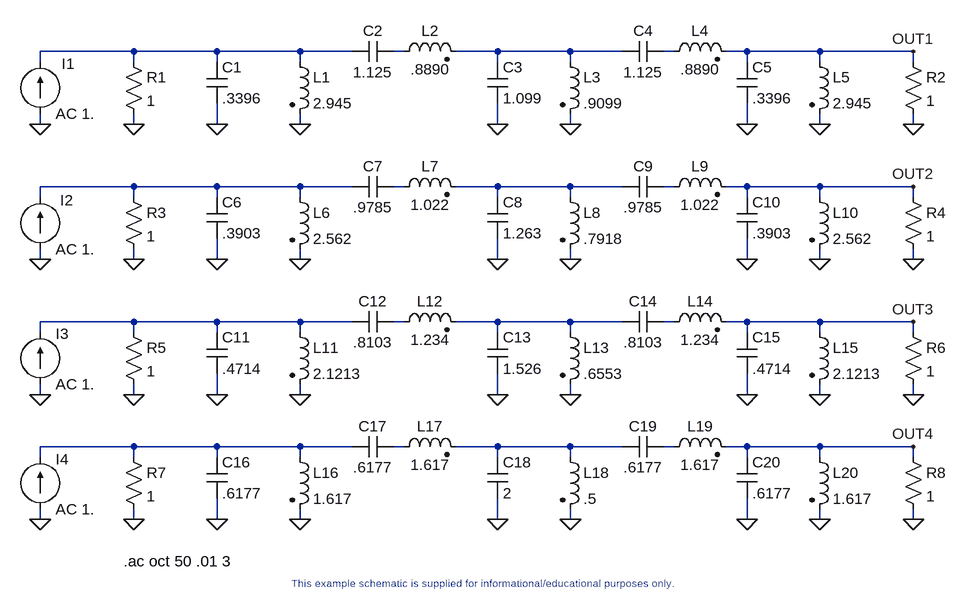
[diagram p0: schematic butter.asc]
butter.asc, the LTspice schematic file:
Version 4
SHEET 1 2536 1712
WIRE 1040 512 896 512
WIRE 1168 512 1040 512
WIRE 1296 512 1168 512
WIRE 1376 512 1296 512
WIRE 1456 512 1440 512
WIRE 1600 512 1536 512
WIRE 1712 512 1600 512
WIRE 1792 512 1712 512
WIRE 1872 512 1856 512
WIRE 1984 512 1952 512
WIRE 2096 512 1984 512
WIRE 2240 512 2096 512
WIRE 896 528 896 512
WIRE 1040 528 1040 512
WIRE 1168 528 1168 512
WIRE 1296 528 1296 512
WIRE 1600 528 1600 512
WIRE 1712 528 1712 512
WIRE 1984 528 1984 512
WIRE 2096 528 2096 512
WIRE 2240 528 2240 512
WIRE 896 624 896 608
WIRE 1040 624 1040 608
WIRE 1168 624 1168 592
WIRE 1296 624 1296 608
WIRE 1600 624 1600 592
WIRE 1712 624 1712 608
WIRE 1984 624 1984 592
WIRE 2096 624 2096 608
WIRE 2240 624 2240 608
WIRE 1040 720 896 720
WIRE 1168 720 1040 720
WIRE 1296 720 1168 720
WIRE 1376 720 1296 720
WIRE 1456 720 1440 720
WIRE 1600 720 1536 720
WIRE 1712 720 1600 720
WIRE 1792 720 1712 720
WIRE 1872 720 1856 720
WIRE 1984 720 1952 720
WIRE 2096 720 1984 720
WIRE 2240 720 2096 720
WIRE 896 736 896 720
WIRE 1040 736 1040 720
WIRE 1168 736 1168 720
WIRE 1296 736 1296 720
WIRE 1600 736 1600 720
WIRE 1712 736 1712 720
WIRE 1984 736 1984 720
WIRE 2096 736 2096 720
WIRE 2240 736 2240 720
WIRE 896 832 896 816
WIRE 1040 832 1040 816
WIRE 1168 832 1168 800
WIRE 1296 832 1296 816
WIRE 1600 832 1600 800
WIRE 1712 832 1712 816
WIRE 1984 832 1984 800
WIRE 2096 832 2096 816
WIRE 2240 832 2240 816
WIRE 1040 928 896 928
WIRE 1168 928 1040 928
WIRE 1296 928 1168 928
WIRE 1376 928 1296 928
WIRE 1456 928 1440 928
WIRE 1600 928 1536 928
WIRE 1712 928 1600 928
WIRE 1792 928 1712 928
WIRE 1872 928 1856 928
WIRE 1984 928 1952 928
WIRE 2096 928 1984 928
WIRE 2240 928 2096 928
WIRE 896 944 896 928
WIRE 1040 944 1040 928
WIRE 1168 944 1168 928
WIRE 1296 944 1296 928
WIRE 1600 944 1600 928
WIRE 1712 944 1712 928
WIRE 1984 944 1984 928
WIRE 2096 944 2096 928
WIRE 2240 944 2240 928
WIRE 896 1040 896 1024
WIRE 1040 1040 1040 1024
WIRE 1168 1040 1168 1008
WIRE 1296 1040 1296 1024
WIRE 1600 1040 1600 1008
WIRE 1712 1040 1712 1024
WIRE 1984 1040 1984 1008
WIRE 2096 1040 2096 1024
WIRE 2240 1040 2240 1024
WIRE 1040 1120 896 1120
WIRE 1168 1120 1040 1120
WIRE 1296 1120 1168 1120
WIRE 1376 1120 1296 1120
WIRE 1456 1120 1440 1120
WIRE 1600 1120 1536 1120
WIRE 1712 1120 1600 1120
WIRE 1792 1120 1712 1120
WIRE 1872 1120 1856 1120
WIRE 1984 1120 1952 1120
WIRE 2096 1120 1984 1120
WIRE 2240 1120 2096 1120
WIRE 896 1136 896 1120
WIRE 1040 1136 1040 1120
WIRE 1168 1136 1168 1120
WIRE 1296 1136 1296 1120
WIRE 1600 1136 1600 1120
WIRE 1712 1136 1712 1120
WIRE 1984 1136 1984 1120
WIRE 2096 1136 2096 1120
WIRE 2240 1136 2240 1120
WIRE 896 1232 896 1216
WIRE 1040 1232 1040 1216
WIRE 1168 1232 1168 1200
WIRE 1296 1232 1296 1216
WIRE 1600 1232 1600 1200
WIRE 1712 1232 1712 1216
WIRE 1984 1232 1984 1200
WIRE 2096 1232 2096 1216
WIRE 2240 1232 2240 1216
FLAG 2240 1120 OUT4
FLAG 2240 928 OUT3
FLAG 2240 720 OUT2
FLAG 2240 512 OUT1
FLAG 896 624 0
FLAG 1040 624 0
FLAG 1168 624 0
FLAG 1296 624 0
FLAG 1600 624 0
FLAG 1712 624 0
FLAG 1984 624 0
FLAG 2096 624 0
FLAG 2240 624 0
FLAG 896 832 0
FLAG 1040 832 0
FLAG 1168 832 0
FLAG 1296 832 0
FLAG 1600 832 0
FLAG 1712 832 0
FLAG 1984 832 0
FLAG 2096 832 0
FLAG 2240 832 0
FLAG 896 1040 0
FLAG 1040 1040 0
FLAG 1168 1040 0
FLAG 1296 1040 0
FLAG 1600 1040 0
FLAG 1712 1040 0
FLAG 1984 1040 0
FLAG 2096 1040 0
FLAG 2240 1040 0
FLAG 896 1232 0
FLAG 1040 1232 0
FLAG 1168 1232 0
FLAG 1296 1232 0
FLAG 1600 1232 0
FLAG 1712 1232 0
FLAG 1984 1232 0
FLAG 2096 1232 0
FLAG 2240 1232 0
SYMBOL CURRENT 896 608 M180
WINDOW 0 33 77 Left 2
WINDOW 3 24 0 Left 2
SYMATTR InstName I1
SYMATTR Value AC 1.
SYMBOL CURRENT 896 816 M180
WINDOW 0 31 75 Left 2
WINDOW 3 24 0 Left 2
SYMATTR InstName I2
SYMATTR Value AC 1.
SYMBOL CURRENT 896 1024 M180
WINDOW 0 24 78 Left 2
WINDOW 3 24 0 Left 2
SYMATTR InstName I3
SYMATTR Value AC 1.
SYMBOL CURRENT 896 1216 M180
WINDOW 0 24 77 Left 2
WINDOW 3 24 0 Left 2
SYMATTR InstName I4
SYMATTR Value AC 1.
SYMBOL RES 1024 512 R0
SYMATTR InstName R1
SYMATTR Value 1
SYMBOL CAP 1856 496 R90
WINDOW 0 0 32 VBottom 2
WINDOW 3 32 32 VTop 2
SYMATTR InstName C4
SYMATTR Value 1.125
SYMBOL CAP 1968 528 R0
SYMATTR InstName C5
SYMATTR Value .3396
SYMBOL CAP 1440 496 R90
WINDOW 0 0 32 VBottom 2
WINDOW 3 32 32 VTop 2
SYMATTR InstName C2
SYMATTR Value 1.125
SYMBOL CAP 1584 528 R0
SYMATTR InstName C3
SYMATTR Value 1.099
SYMBOL CAP 1152 528 R0
SYMATTR InstName C1
SYMATTR Value .3396
SYMBOL CAP 1856 704 R90
WINDOW 0 0 32 VBottom 2
WINDOW 3 32 32 VTop 2
SYMATTR InstName C9
SYMATTR Value .9785
SYMBOL CAP 1968 736 R0
SYMATTR InstName C10
SYMATTR Value .3903
SYMBOL CAP 1440 704 R90
WINDOW 0 0 32 VBottom 2
WINDOW 3 32 32 VTop 2
SYMATTR InstName C7
SYMATTR Value .9785
SYMBOL CAP 1584 736 R0
SYMATTR InstName C8
SYMATTR Value 1.263
SYMBOL CAP 1152 736 R0
SYMATTR InstName C6
SYMATTR Value .3903
SYMBOL CAP 1856 912 R90
WINDOW 0 0 32 VBottom 2
WINDOW 3 32 32 VTop 2
SYMATTR InstName C14
SYMATTR Value .8103
SYMBOL CAP 1968 944 R0
SYMATTR InstName C15
SYMATTR Value .4714
SYMBOL CAP 1440 912 R90
WINDOW 0 0 32 VBottom 2
WINDOW 3 32 32 VTop 2
SYMATTR InstName C12
SYMATTR Value .8103
SYMBOL CAP 1584 944 R0
SYMATTR InstName C13
SYMATTR Value 1.526
SYMBOL CAP 1152 944 R0
SYMATTR InstName C11
SYMATTR Value .4714
SYMBOL CAP 1856 1104 R90
WINDOW 0 0 32 VBottom 2
WINDOW 3 32 32 VTop 2
SYMATTR InstName C19
SYMATTR Value .6177
SYMBOL CAP 1968 1136 R0
SYMATTR InstName C20
SYMATTR Value .6177
SYMBOL CAP 1440 1104 R90
WINDOW 0 0 32 VBottom 2
WINDOW 3 32 32 VTop 2
SYMATTR InstName C17
SYMATTR Value .6177
SYMBOL CAP 1584 1136 R0
SYMATTR InstName C18
SYMATTR Value 2
SYMBOL CAP 1152 1136 R0
SYMATTR InstName C16
SYMATTR Value .6177
SYMBOL IND2 1856 528 R270
WINDOW 0 32 56 VTop 2
WINDOW 3 4 56 VBottom 2
SYMATTR InstName L4
SYMATTR Value .8890
SYMBOL IND2 2080 512 R0
SYMATTR InstName L5
SYMATTR Value 2.945
SYMBOL IND2 1440 528 R270
WINDOW 0 32 56 VTop 2
WINDOW 3 4 56 VBottom 2
SYMATTR InstName L2
SYMATTR Value .8890
SYMBOL IND2 1696 512 R0
SYMATTR InstName L3
SYMATTR Value .9099
SYMBOL IND2 1280 512 R0
SYMATTR InstName L1
SYMATTR Value 2.945
SYMBOL IND2 1856 736 R270
WINDOW 0 32 56 VTop 2
WINDOW 3 4 56 VBottom 2
SYMATTR InstName L9
SYMATTR Value 1.022
SYMBOL IND2 2080 720 R0
SYMATTR InstName L10
SYMATTR Value 2.562
SYMBOL IND2 1440 736 R270
WINDOW 0 32 56 VTop 2
WINDOW 3 4 56 VBottom 2
SYMATTR InstName L7
SYMATTR Value 1.022
SYMBOL IND2 1696 720 R0
SYMATTR InstName L8
SYMATTR Value .7918
SYMBOL IND2 1280 720 R0
SYMATTR InstName L6
SYMATTR Value 2.562
SYMBOL IND2 1856 944 R270
WINDOW 0 32 56 VTop 2
WINDOW 3 4 56 VBottom 2
SYMATTR InstName L14
SYMATTR Value 1.234
SYMBOL IND2 2080 928 R0
SYMATTR InstName L15
SYMATTR Value 2.1213
SYMBOL IND2 1440 944 R270
WINDOW 0 32 56 VTop 2
WINDOW 3 4 56 VBottom 2
SYMATTR InstName L12
SYMATTR Value 1.234
SYMBOL IND2 1696 928 R0
SYMATTR InstName L13
SYMATTR Value .6553
SYMBOL IND2 1280 928 R0
SYMATTR InstName L11
SYMATTR Value 2.1213
SYMBOL IND2 1856 1136 R270
WINDOW 0 32 56 VTop 2
WINDOW 3 4 56 VBottom 2
SYMATTR InstName L19
SYMATTR Value 1.617
SYMBOL IND2 2080 1120 R0
SYMATTR InstName L20
SYMATTR Value 1.617
SYMBOL IND2 1440 1136 R270
WINDOW 0 32 56 VTop 2
WINDOW 3 4 56 VBottom 2
SYMATTR InstName L17
SYMATTR Value 1.617
SYMBOL IND2 1696 1120 R0
SYMATTR InstName L18
SYMATTR Value .5
SYMBOL IND2 1280 1120 R0
SYMATTR InstName L16
SYMATTR Value 1.617
SYMBOL RES 2224 512 R0
SYMATTR InstName R2
SYMATTR Value 1
SYMBOL RES 1024 720 R0
SYMATTR InstName R3
SYMATTR Value 1
SYMBOL RES 2224 720 R0
SYMATTR InstName R4
SYMATTR Value 1
SYMBOL RES 1024 928 R0
SYMATTR InstName R5
SYMATTR Value 1
SYMBOL RES 2224 928 R0
SYMATTR InstName R6
SYMATTR Value 1
SYMBOL RES 1024 1120 R0
SYMATTR InstName R7
SYMATTR Value 1
SYMBOL RES 2224 1120 R0
SYMATTR InstName R8
SYMATTR Value 1
TEXT 1024 1296 Left 2 !.ac oct 50 .01 3
TEXT 1568 1320 Top 1 ;This example schematic is supplied for informational/educational purposes only.

The netlist it stands for:
* butter.asc
I1 0 N001 AC 1.
I2 0 N005 AC 1.
I3 0 N009 AC 1.
I4 0 N013 AC 1.
R1 N001 0 1
C4 N004 N003 1.125
C5 OUT1 0 .3396
C2 N002 N001 1.125
C3 N003 0 1.099
C1 N001 0 .3396
C9 N008 N007 .9785
C10 OUT2 0 .3903
C7 N006 N005 .9785
C8 N007 0 1.263
C6 N005 0 .3903
C14 N012 N011 .8103
C15 OUT3 0 .4714
C12 N010 N009 .8103
C13 N011 0 1.526
C11 N009 0 .4714
C19 N016 N015 .6177
C20 OUT4 0 .6177
C17 N014 N013 .6177
C18 N015 0 2
C16 N013 0 .6177
L4 N004 OUT1 .8890
L5 OUT1 0 2.945
L2 N002 N003 .8890
L3 N003 0 .9099
L1 N001 0 2.945
L9 N008 OUT2 1.022
L10 OUT2 0 2.562
L7 N006 N007 1.022
L8 N007 0 .7918
L6 N005 0 2.562
L14 N012 OUT3 1.234
L15 OUT3 0 2.1213
L12 N010 N011 1.234
L13 N011 0 .6553
L11 N009 0 2.1213
L19 N016 OUT4 1.617
L20 OUT4 0 1.617
L17 N014 N015 1.617
L18 N015 0 .5
L16 N013 0 1.617
R2 OUT1 0 1
R3 N005 0 1
R4 OUT2 0 1
R5 N009 0 1
R6 OUT3 0 1
R7 N013 0 1
R8 OUT4 0 1
.ac oct 50 .01 3
* This example schematic is supplied for informational/educational purposes only.
.backanno
.end